# Altium schematic sheet 09 CARD-USB-WIFI.SchDoc
size 420 x 297 mm
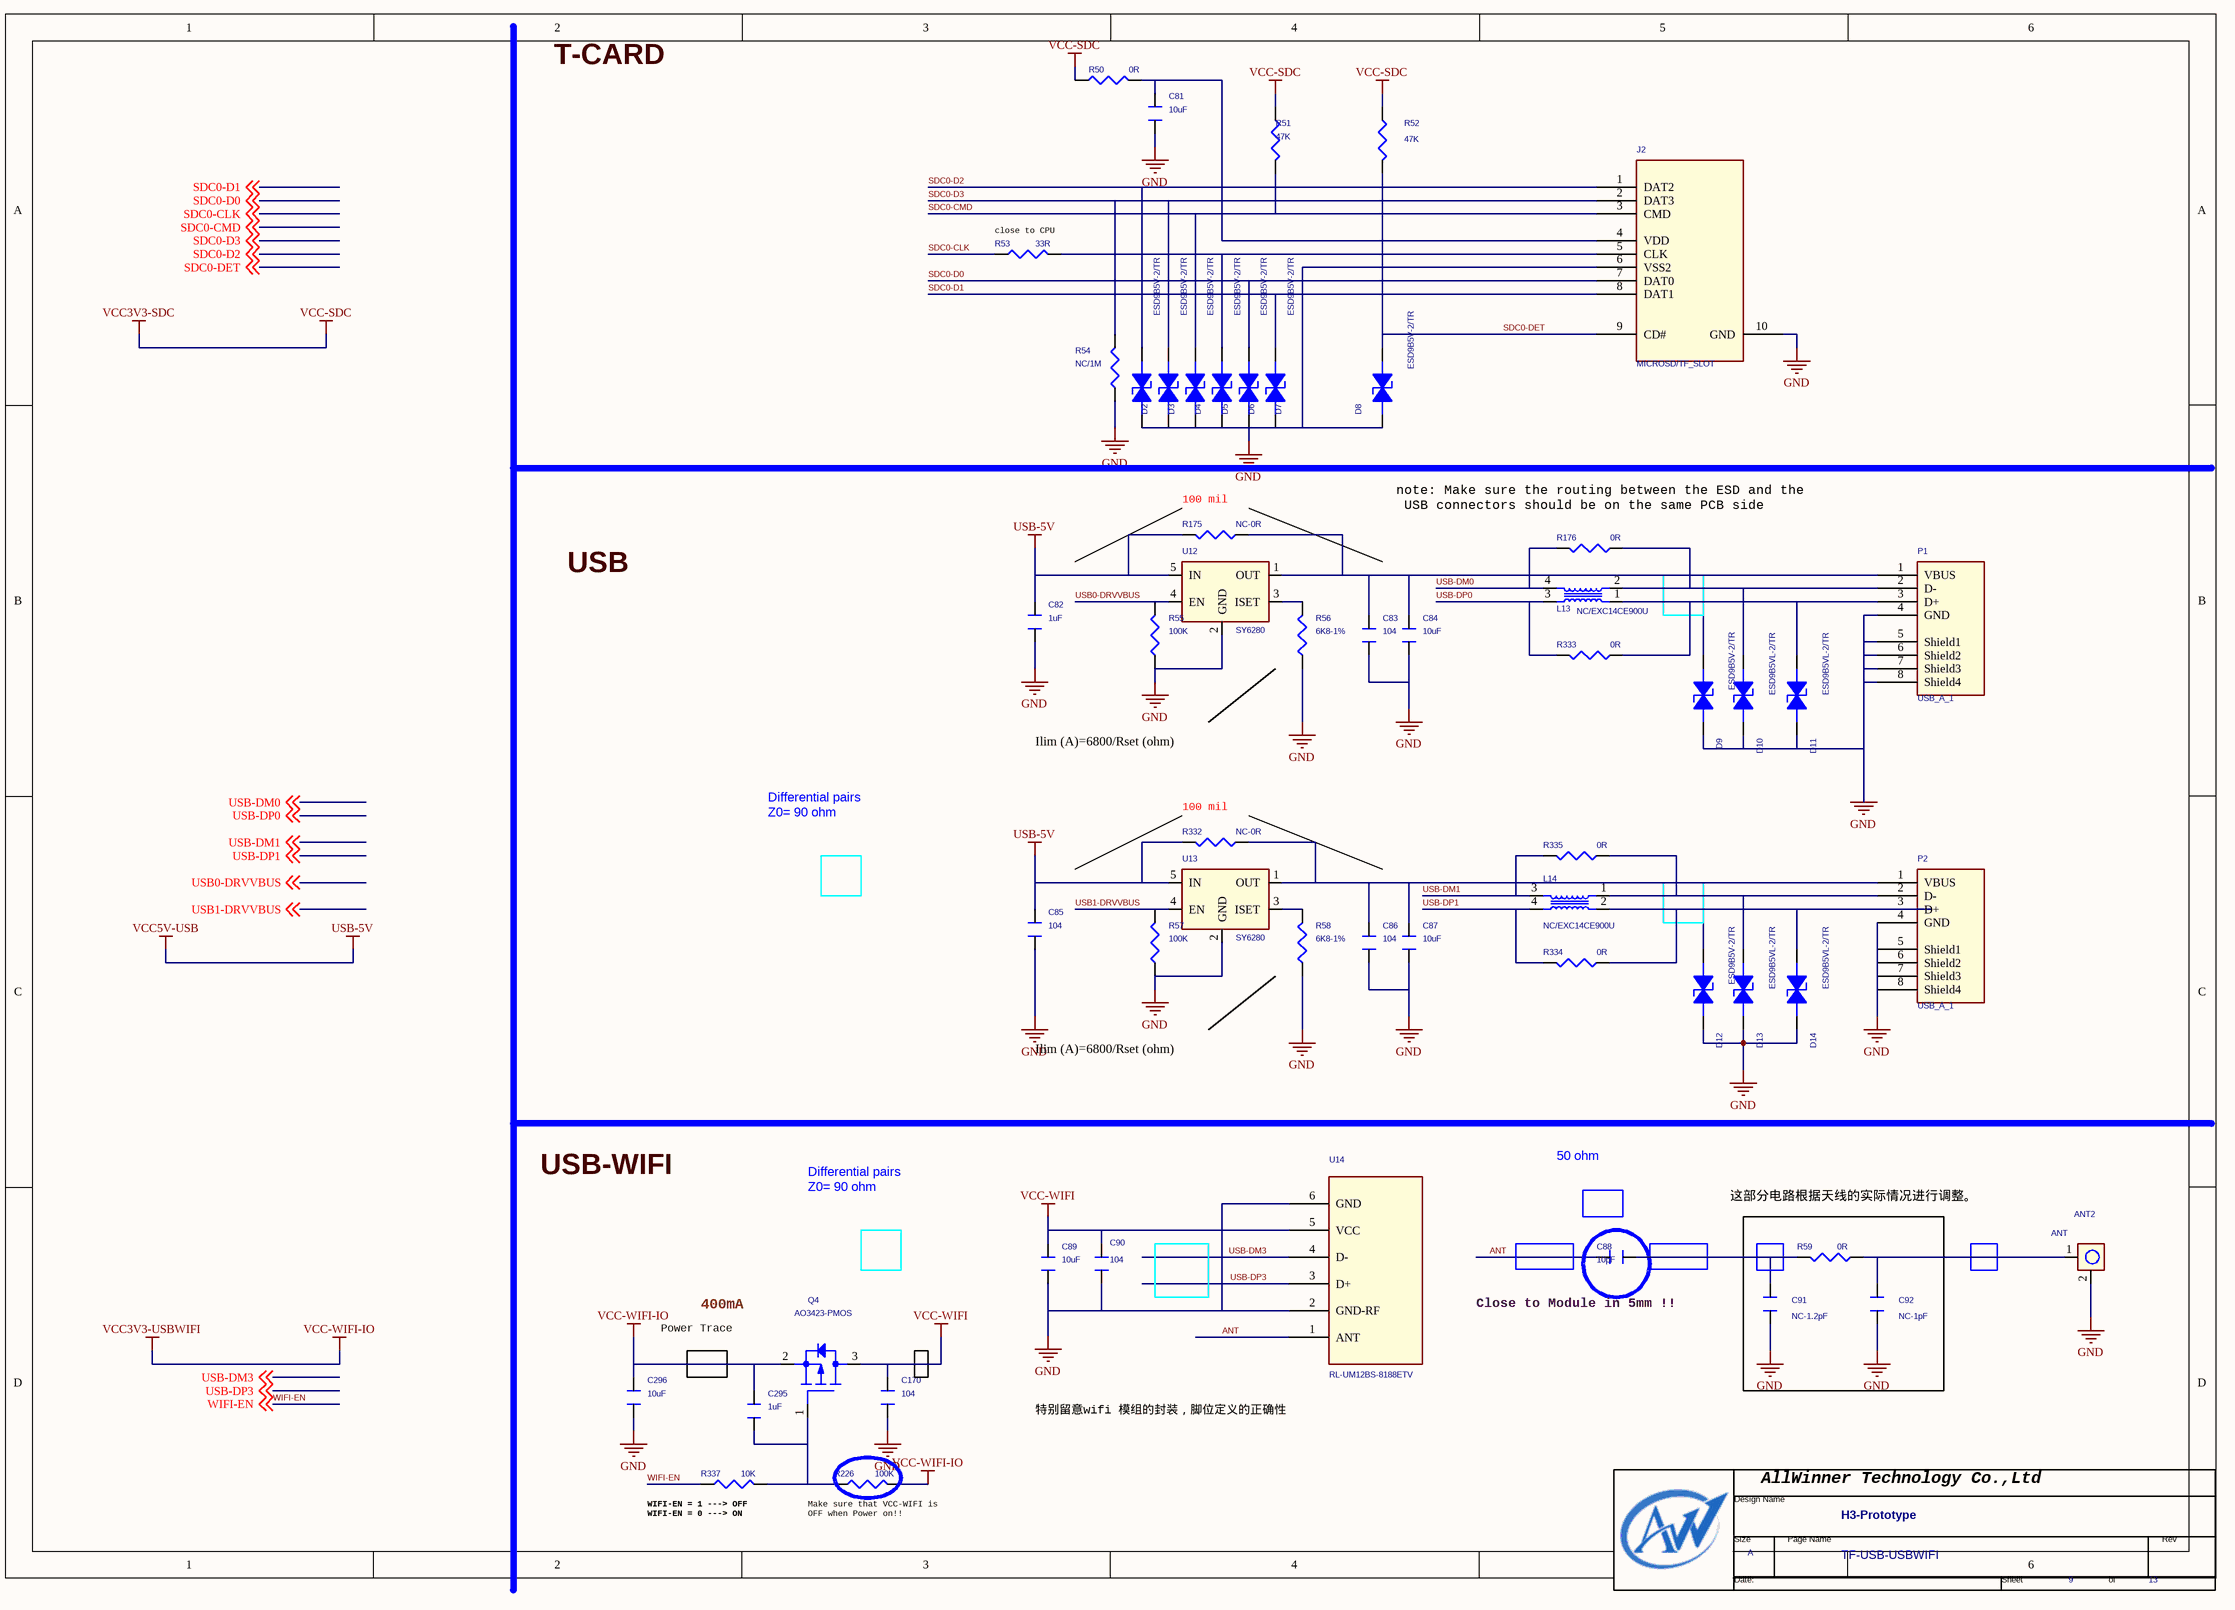
[diagram p0: 09 CARD-USB-WIFI.SchDoc]

## Parts
*  Page Count: 13  Page Number: 9  Page Size: A  Title: H3-Prototype  Doc: TF-USB-USBWIFI  (hidden comment: TitleBlock0-AW)  (graphical)
ANT2  ANT  [ANT30]
C81  10uF  [C0402]
C82  1uF  [C0402]
C83  104  [C0402]
C84  10uF  [C0603]
C85  104  [C0402]
C86  104  [C0402]
C87  10uF  [C0603]
C88  10pF  [C0402]
C89  10uF  [C0603]
C90  104  [C0402]
C91  NC-1.2pF  [C0402]
C92  NC-1pF  [C0402]
C170  104  [C0402]
C295  1uF  [C0402]
C296  10uF  [C0805]
D2  ESD9B5V-2/TR  [TVS0402]
D3  ESD9B5V-2/TR  [TVS0402]
D4  ESD9B5V-2/TR  [TVS0402]
D5  ESD9B5V-2/TR  [TVS0402]
D6  ESD9B5V-2/TR  [TVS0402]
D7  ESD9B5V-2/TR  [TVS0402]
D8  ESD9B5V-2/TR  [TVS0402]
D9  ESD9B5V-2/TR  [C0402]
D10  ESD9B5VL-2/TR  [C0402]
D11  ESD9B5VL-2/TR  [C0402]
D12  ESD9B5V-2/TR  [C0402]
D13  ESD9B5VL-2/TR  [C0402]
D14  ESD9B5VL-2/TR  [C0402]
J2  MICROSD/TF_SLOT  [TF9P]
L13  NC/EXC14CE900U  [esd4p0_8b1_6x3_0]
L14  NC/EXC14CE900U  [esd4p0_8b1_6x3_0]
P1  USB_A_1  [USB_A_1]
P2  USB_A_1  [USB_A_1]
Q4  AO3423-PMOS  [SOT-23]
R50  0R  [R0402]
R51  47K  [R0402]
R52  47K  [R0402]
R53  33R  [R0402]
R54  NC/1M  [R0402]
R55  100K  [R0402]
R56  6K8-1%  [R0402]
R57  100K  [R0402]
R58  6K8-1%  [R0402]
R59  0R  [R0402]
R175  NC-0R  [R1206]
R176  0R  [R0402]
R226  100K  [0805]
R332  NC-0R  [R1206]
R333  0R  [R0402]
R334  0R  [R0402]
R335  0R  [R0402]
R337  10K  [0805]
U12  SY6280  [SOT23-6]
U13  SY6280  [SOT23-6]
U14  RL-UM12BS-8188ETV  [SOP6P2_00B12_96X_22]

## Nets
GND: ANT2.2 C81.1 C82.1 C83.1 C84.1 C85.1 C86.1 C87.1 C89.1 C90.2 C91.2 C92.2 C170.2 C296.2 D2.2(CATHODE) D3.2(CATHODE) D4.2(CATHODE) D5.2(CATHODE) D6.2(CATHODE) D7.2(CATHODE) D8.2(CATHODE) D9.2(CATHODE) D10.2(CATHODE) D11.2(CATHODE) D12.2(CATHODE) D13.2(CATHODE) D14.2(CATHODE) J2.6(VSS2) J2.10(GND) P1.4(GND) P1.5(Shield1) P1.6(Shield2) P1.7(Shield3) P1.8(Shield4) P2.4(GND) P2.5(Shield1) P2.6(Shield2) P2.7(Shield3) P2.8(Shield4) R54.1 R55.1 R56.1 R57.1 R58.1 U12.2(GND) U13.2(GND) U14.2(GND-RF) U14.6(GND)
USB-5V: C82.2 C85.2 R175.2 R332.2 U12.5(IN) U13.5(IN)  [also labelled VCC5V-USB]
VCC-SDC: R50.1 R51.1 R52.1  [also labelled VCC3V3-SDC]
VCC-WIFI: C89.2 C90.1 C170.1 Q4.3(DRAIN) U14.5(VCC)
VCC-WIFI-IO: C295.1 C296.1 Q4.2(SOURCE) R226.2  [also labelled VCC3V3-USBWIFI]
ANT: C88.2 U14.1(ANT)
SDC0-CLK: R53.1 ; off-sheet SDC0-CLK
SDC0-CMD: D4.1(ANODE) J2.3(CMD) R51.2 ; off-sheet SDC0-CMD
SDC0-D0: D6.1(ANODE) J2.7(DAT0) ; off-sheet SDC0-D0
SDC0-D1: D7.1(ANODE) J2.8(DAT1) ; off-sheet SDC0-D1
SDC0-D2: D2.1(ANODE) J2.1(DAT2) ; off-sheet SDC0-D2
SDC0-D3: D3.1(ANODE) J2.2(DAT3) R54.2 ; off-sheet SDC0-D3
SDC0-DET: D8.1(ANODE) J2.9(CD#) R52.2 ; off-sheet SDC0-DET
USB0-DRVVBUS: R55.2 U12.4(EN) ; off-sheet USB0-DRVVBUS
USB1-DRVVBUS: R57.2 U13.4(EN) ; off-sheet USB1-DRVVBUS
USB-DM0: L13.4(R4) R176.2 ; off-sheet USB-DM0
USB-DM1: L14.3(R3) R335.2 ; off-sheet USB-DM1
USB-DM3: U14.4(D-) ; off-sheet USB-DM3
USB-DP0: L13.3(R3) R333.2 ; off-sheet USB-DP0
USB-DP1: L14.4(R4) R334.2 ; off-sheet USB-DP1
USB-DP3: U14.3(D+) ; off-sheet USB-DP3
WIFI-EN: R337.1 ; off-sheet WIFI-EN
NetANT2_1: ANT2.1 C92.1 R59.2
NetC81_2: C81.2 J2.4(VDD) R50.2
NetC83_2: C83.2 C84.2 D9.1(ANODE) P1.1(VBUS) R175.1 U12.1(OUT)
NetC86_2: C86.2 C87.2 D12.1(ANODE) P2.1(VBUS) R332.1 U13.1(OUT)
NetC88_1: C88.1 C91.1 R59.1
NetC295_2: C295.2 Q4.1(GATE) R226.1 R337.2
NetD5_1: D5.1(ANODE) J2.5(CLK) R53.2
NetD10_1: D10.1(ANODE) L13.2(R2) P1.2(D-) R176.1
NetD11_1: D11.1(ANODE) L13.1(R1) P1.3(D+) R333.1
NetD13_1: D13.1(ANODE) L14.1(R1) P2.2(D-) R335.1
NetD14_1: D14.1(ANODE) L14.2(R2) P2.3(D+) R334.1
NetR56_2: R56.2 U12.3(ISET)
NetR58_2: R58.2 U13.3(ISET)

## Notes on the sheet
- T-CARD
- (near R53) close to CPU
- (near R175) 100 mil
- (near R176) note: Make sure the routing between the ESD and the
  USB connectors should be on the same PCB side
- USB
- Differential pairs
  Z0= 90 ohm
- Ilim (A)=6800/Rset (ohm)
- (near R332) 100 mil
- USB-WIFI
- 50 ohm
- (near R59) 这部分电路根据天线的实际情况进行调整。
- Power Trace
- 400mA
- (near C88) Close to Module in 5mm !!
- 特别留意wifi 模组的封装，脚位定义的正确性
- (near R337) WIFI-EN = 1 ---> OFF
  WIFI-EN = 0 ---> ON
- (near R226) Make sure that VCC-WIFI is
  OFF when Power on!!
- (in symbol TitleBlock0-AW) AllWinner Technology Co.,Ltd; Design Name; Size; Page Name; Rev; Date:; Sheet; of

## Library data of the parts
ANT2 = ANT_0: WIFI_ANT
C81 = CAPACITOR: PAGE: 3
C82-C87 = CAPACITOR
C88 C90-C92 = CAPACITOR_0_Dup3: PAGE: 2
C89 = CAPACITOR_0_Dup3: PAGE: 1
C170 C295 C296 = CAPACITOR_0: PAGE: 1
D2-D14 = 1_1.5KE100A_Dup1: 1ST PART DESCRIPTION: WILL ESD9B5V Bidirection ESD Protection
J2 = SDMMC SLOT_11
L13 L14 = R-PACK4_1
Q4 = PMOS_0
R50-R54 = R_Dup4
R55-R58 R175 R176 R332-R335 = R_Dup3
R59 = R_Dup2
R226 R337 = R1_0805
U12 U13 = RT9266PE_2
U14 = MINI USB-B_5
* = TitleBlock0-AW: Page Create Date: March  8, 1995